# EAGLE schematic PowerPCB (EAGLE 9.4.2)
Assembly variants: basic, pinout

## Sheet 1 of 2: DC-DC converters
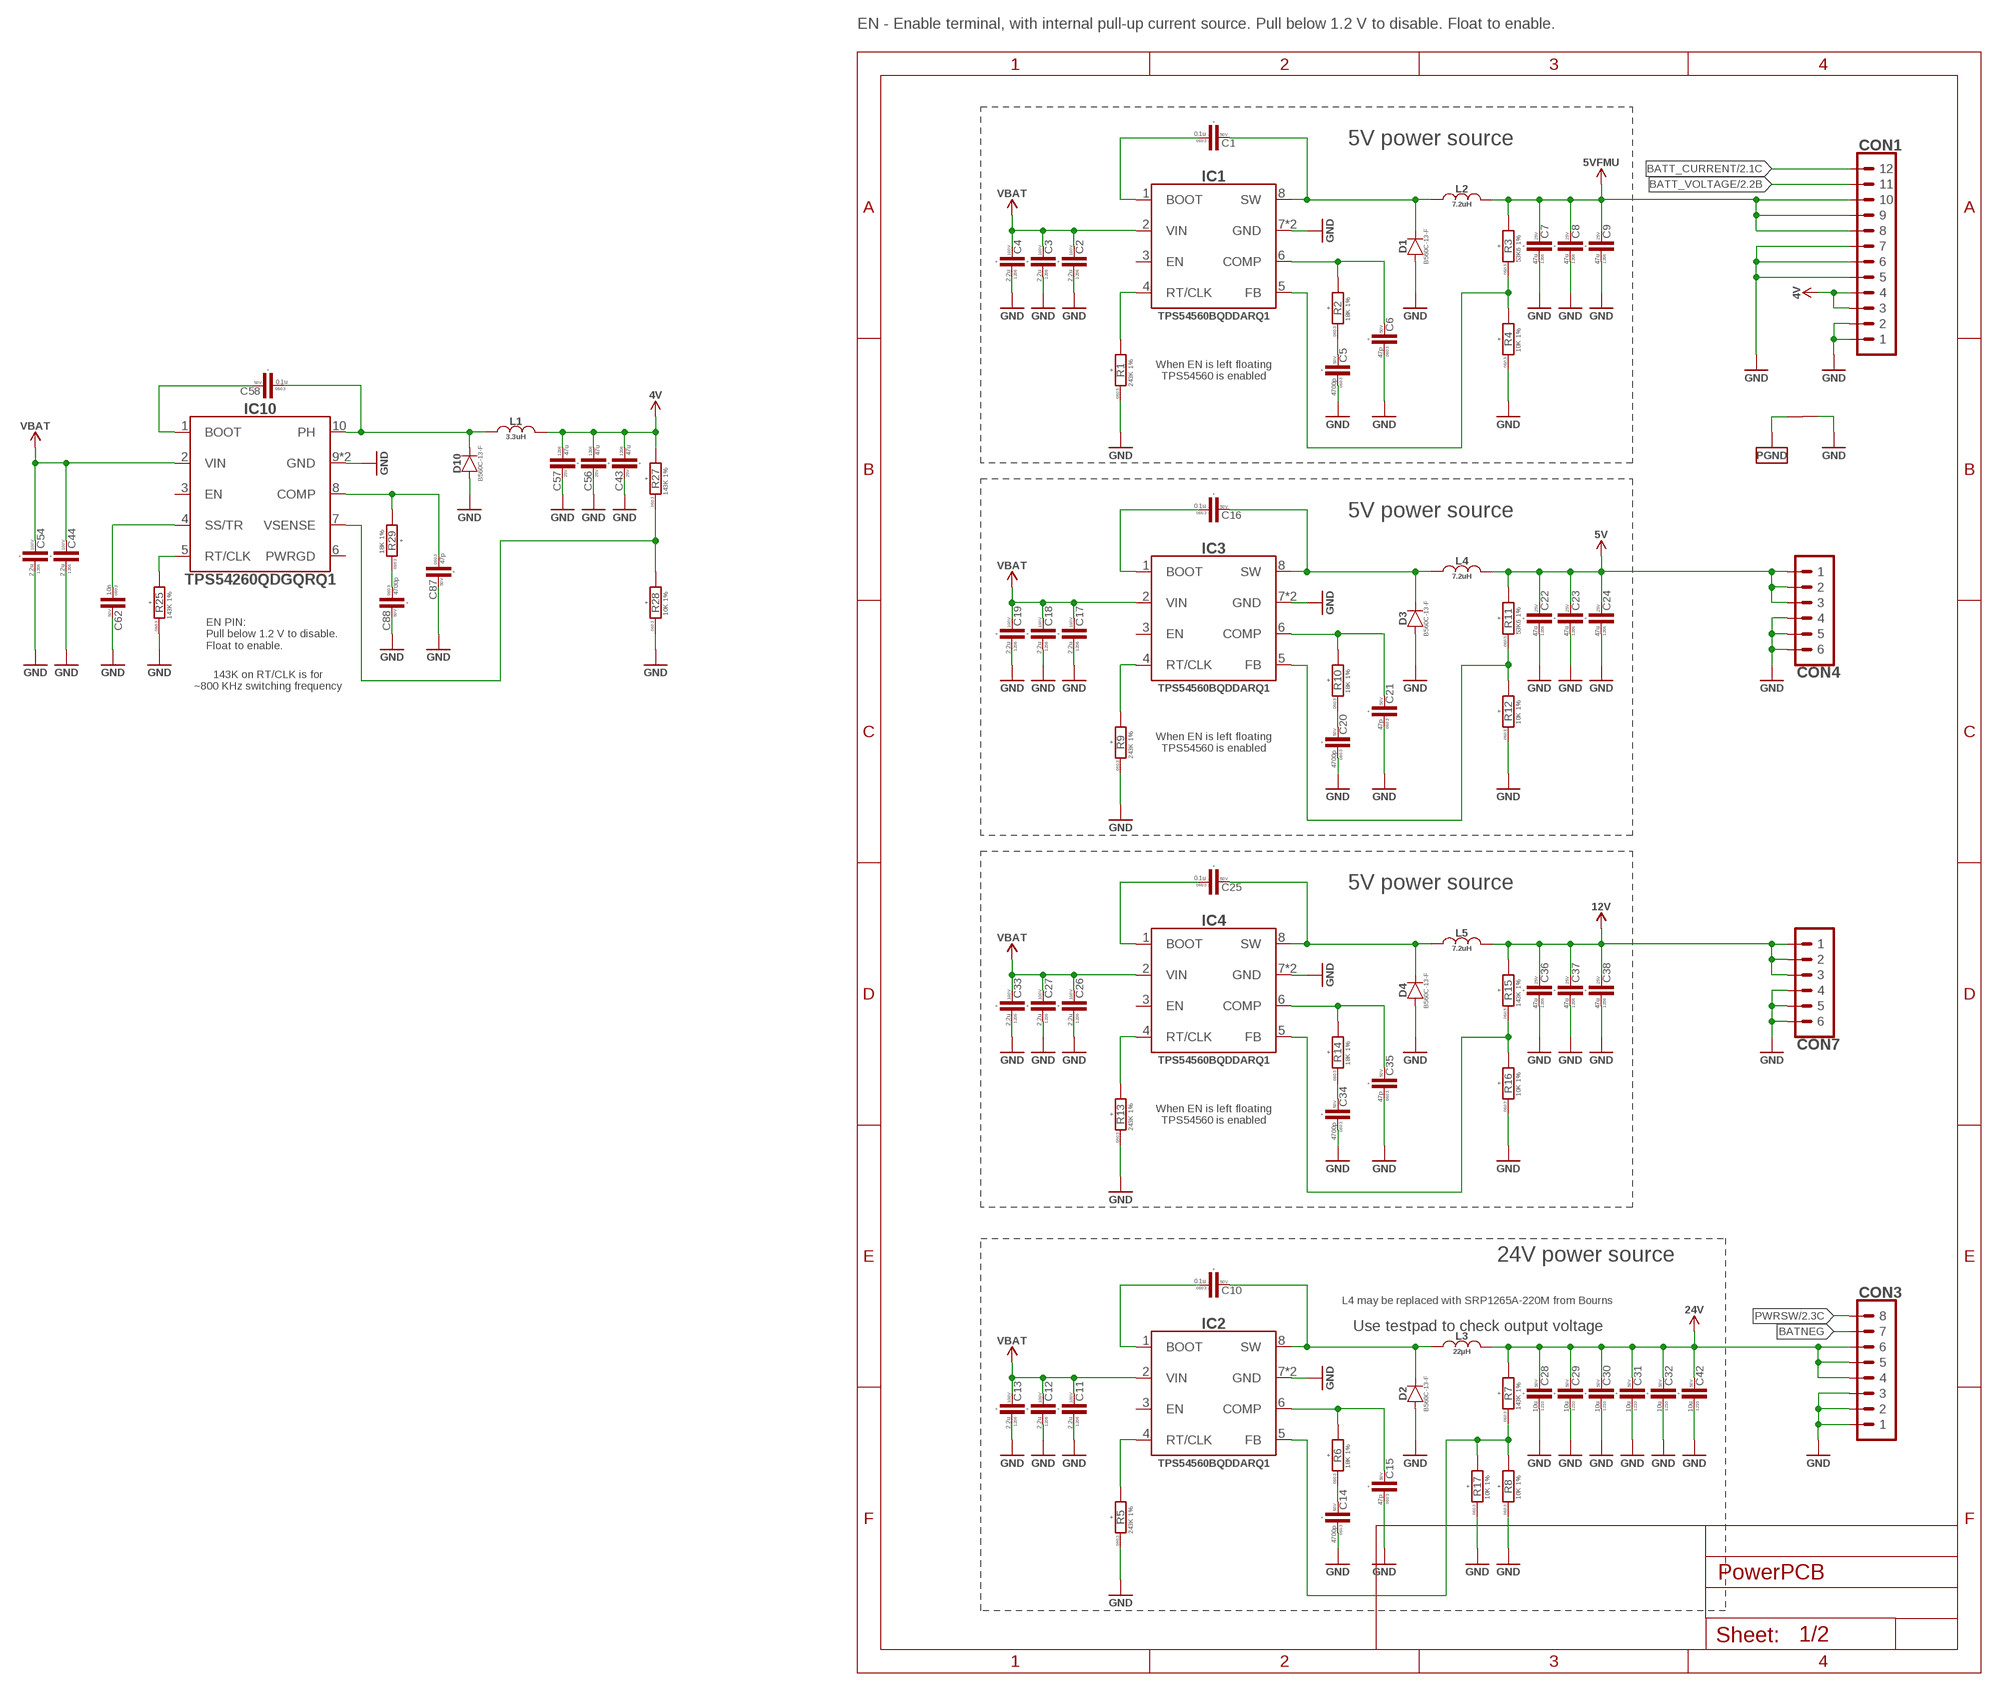
[diagram p0: schematic, sheet 1]

### Parts
C1  0.1u  C-0603  [C0603]
C2  2.2u  C-1206  [C1206]
C3  2.2u  C-1206  [C1206]
C4  2.2u  C-1206  [C1206]
C5  4700p  C-0603  [C0603]
C6  47p  C-0603  [C0603]
C7  47u  C-1206  [C1206]
C8  47u  C-1206  [C1206]
C9  47u  C-1206  [C1206]
C10  0.1u  C-0603  [C0603]
C11  2.2u  C-1206  [C1206]
C12  2.2u  C-1206  [C1206]
C13  2.2u  C-1206  [C1206]
C14  4700p  C-0603  [C0603]
C15  47p  C-0603  [C0603]
C16  0.1u  C-0603  [C0603]
C17  2.2u  C-1206  [C1206]
C18  2.2u  C-1206  [C1206]
C19  2.2u  C-1206  [C1206]
C20  4700p  C-0603  [C0603]
C21  47p  C-0603  [C0603]
C22  47u  C-1206  [C1206]
C23  47u  C-1206  [C1206]
C24  47u  C-1206  [C1206]
C25  0.1u  C-0603  [C0603]
C26  2.2u  C-1206  [C1206]
C27  2.2u  C-1206  [C1206]
C28  10u  C-1210  [C1210]
C29  10u  C-1210  [C1210]
C30  10u  C-1210  [C1210]
C31  10u  C-1210  [C1210]
C32  10u  C-1210  [C1210]
C33  2.2u  C-1206  [C1206]
C34  4700p  C-0603  [C0603]
C35  47p  C-0603  [C0603]
C36  47u  C-1206  [C1206]
C37  47u  C-1206  [C1206]
C38  47u  C-1206  [C1206]
C42  10u  C-1210  [C1210]
C43  47u  C-1206  [C1206]
C44  2.2u  C-1206  [C1206]
C54  2.2u  C-1206  [C1206]
C56  47u  C-1206  [C1206]
C57  47u  C-1206  [C1206]
C58  0.1u  C-0603  [C0603]
C62  10n  C-0603  [C0603]
C87  47p  C-0603  [C0603]
C88  4700p  C-0603  [C0603]
CON1  PINHEAD_1X12-2.54-FEMALE  [1X12-PTH-2.54-FEMALE]
CON3  PINHEAD_1X08-2.54-FEMALE  [1X08-PTH-2.54-FEMALE]
CON4  PINHEAD_1X06-2.54-FEMALE  [1X06-PTH-2.54-FEMALE]
CON7  PINHEAD_1X06-2.54-FEMALE  [1X06-PTH-2.54-FEMALE]
D1  B560C  [DO-214AB(SMC)]
D2  B560C  [DO-214AB(SMC)]
D3  B560C  [DO-214AB(SMC)]
D4  B560C  [DO-214AB(SMC)]
D10  B560C  [DO-214AB(SMC)]
IC1  TPS54560B  [SOIC8-POWERPAD]
IC2  TPS54560B  [SOIC8-POWERPAD]
IC3  TPS54560B  [SOIC8-POWERPAD]
IC4  TPS54560B  [SOIC8-POWERPAD]
IC10  TPS54260  [MSOP10]
J1  CONNECTION-7MM  [CONNECTION_7MM]
L1  3.3uH  3.3µH-IHLP-202BZ  [IHLP-2020BZ-01]
L2  7.2uH  7.2µH-1064  [1064]
L3  22µH  22µH-SRP1265A  [SRP1265A]
L4  7.2uH  7.2µH-1064  [1064]
L5  7.2uH  7.2µH-1064  [1064]
R1  243K  R-1%-0603  [R0603]
R2  18K  R-1%-0603  [R0603]
R3  53K6  R-1%-0603  [R0603]
R4  10K  R-1%-0603  [R0603]
R5  243K  R-1%-0603  [R0603]
R6  18K  R-1%-0603  [R0603]
R7  143K  R-1%-0603  [R0603]
R8  10K  R-1%-0603  [R0603]
R9  243K  R-1%-0603  [R0603]
R10  18K  R-1%-0603  [R0603]
R11  53K6  R-1%-0603  [R0603]
R12  10K  R-1%-0603  [R0603]
R13  243K  R-1%-0603  [R0603]
R14  18K  R-1%-0603  [R0603]
R15  143K  R-1%-0603  [R0603]
R16  10K  R-1%-0603  [R0603]
R17  10K  R-1%-0603  [R0603]
R25  143K  R-1%-0603  [R0603]
R27  143K  R-1%-0603  [R0603]
R28  10K  R-1%-0603  [R0603]
R29  18K  R-1%-0603  [R0603]

### Nets
5VFMU: C7.P$2 C8.P$2 C9.P$2 CON1.8 CON1.9 CON1.10 L2.2 R3.2 ; also sheet 2
BATNEG: CON3.7 ; also sheet 2
BATT_CURRENT: CON1.12 ; also sheet 2
BATT_VOLTAGE: CON1.11 ; also sheet 2
BOOT: C58.2 IC10.1(BOOT)
BOOT1: C1.1 IC1.1(BOOT)
BOOT2: C16.1 IC3.1(BOOT)
BOOT3: C25.1 IC4.1(BOOT)
GND: C2.P$1 C3.P$1 C4.P$1 C5.1 C6.1 C7.P$1 C8.P$1 C9.P$1 C11.P$1 C12.P$1 C13.P$1 C14.1 C15.1 C17.P$1 C18.P$1 C19.P$1 C20.1 C21.1 C22.P$1 C23.P$1 C24.P$1 C26.P$1 C27.P$1 C28.1 C29.1 C30.1 C31.1 C32.1 C33.P$1 C34.1 C35.1 C36.P$1 C37.P$1 C38.P$1 C42.1 C43.P$2 C44.P$1 C54.P$1 C56.P$2 C57.P$2 C62.2 C87.2 C88.2 CON1.1 CON1.2 CON1.5 CON1.6 CON1.7 CON3.1 CON3.2 CON3.3 CON4.4 CON4.5 CON4.6 CON7.4 CON7.5 CON7.6 D1.A D2.A D3.A D4.A D10.A IC1.7(GND) IC1.P$1(GND) IC2.7(GND) IC2.P$1(GND) IC3.7(GND) IC3.P$1(GND) IC4.7(GND) IC4.P$1(GND) IC10.9(GND) IC10.EP(GND) J1.2 R1.1 R4.1 R5.1 R8.1 R9.1 R12.1 R13.1 R16.1 R17.1 R25.1 R28.1 ; also sheet 2
N$1: IC1.4(RT/CLK) R1.2
N$2: IC3.4(RT/CLK) R9.2
N$3: C6.2 IC1.6(COMP) R2.2
N$4: C5.2 R2.1
N$5: IC1.5(FB) R3.1 R4.2
N$6: C21.2 IC3.6(COMP) R10.2
N$7: C10.1 IC2.1(BOOT)
N$8: C10.2 D2.C IC2.8(SW) L3.1
N$9: IC2.4(RT/CLK) R5.2
N$10: C15.2 IC2.6(COMP) R6.2
N$11: C14.2 R6.1
N$12: IC2.5(FB) R7.1 R8.2 R17.2
N$13: C20.2 R10.1
N$14: IC4.4(RT/CLK) R13.2
N$15: IC3.5(FB) R11.1 R12.2
N$16: C35.2 IC4.6(COMP) R14.2
N$17: C34.2 R14.1
N$18: IC4.5(FB) R15.1 R16.2
N$20: C62.1 IC10.4(SS/TR)
N$38: C87.1 IC10.8(COMP) R29.2
N$39: IC10.5(RT/CLK) R25.2
N$50: C88.1 R29.1
PGND: J1.1 ; also sheet 2
PH: C58.1 D10.C IC10.10(PH) L1.P$1
PWRSW: CON3.8 ; also sheet 2
SW1: C1.2 D1.C IC1.8(SW) L2.1
SW2: C16.2 D3.C IC3.8(SW) L4.1
SW3: C25.2 D4.C IC4.8(SW) L5.1
VBAT [HV]: C2.P$2 C3.P$2 C4.P$2 C11.P$2 C12.P$2 C13.P$2 C17.P$2 C18.P$2 C19.P$2 C26.P$2 C27.P$2 C33.P$2 C44.P$2 C54.P$2 IC1.2(VIN) IC2.2(VIN) IC3.2(VIN) IC4.2(VIN) IC10.2(VIN) ; also sheet 2
VDD_4V: C43.P$1 C56.P$1 C57.P$1 CON1.3 CON1.4 L1.P$2 R27.2 ; supply symbol labelled 4V
VDD_5V: C22.P$2 C23.P$2 C24.P$2 CON4.1 CON4.2 CON4.3 L4.2 R11.2 ; supply symbol labelled 5V
VDD_12V: C36.P$2 C37.P$2 C38.P$2 CON7.1 CON7.2 CON7.3 L5.2 R15.2 ; supply symbol labelled 12V
VDD_24V: C28.2 C29.2 C30.2 C31.2 C32.2 C42.2 CON3.4 CON3.5 CON3.6 L3.2 R7.2 ; supply symbol labelled 24V
VSENSE: IC10.7(VSENSE) R27.1 R28.2
Unconnected: IC1.3(EN) IC2.3(EN) IC3.3(EN) IC4.3(EN) IC10.3(EN) IC10.6(PWRGD)

### Notes on the sheet
- EN - Enable terminal, with internal pull-up current source. Pull below 1.2 V to disable. Float to enable.
- 5V power source
- When EN is left floating
  TPS54560 is enabled
- 5V power source
- EN PIN:
  Pull below 1.2 V to disable. 
  Float to enable.
- 143K on RT/CLK is for
  ~800 KHz switching frequency
- When EN is left floating
  TPS54560 is enabled
- 5V power source
- When EN is left floating
  TPS54560 is enabled
- 24V power source
- L4 may be replaced with SRP1265A-220M from Bourns
- Use testpad to check output voltage

## Sheet 2 of 2: ESC and battery power connections
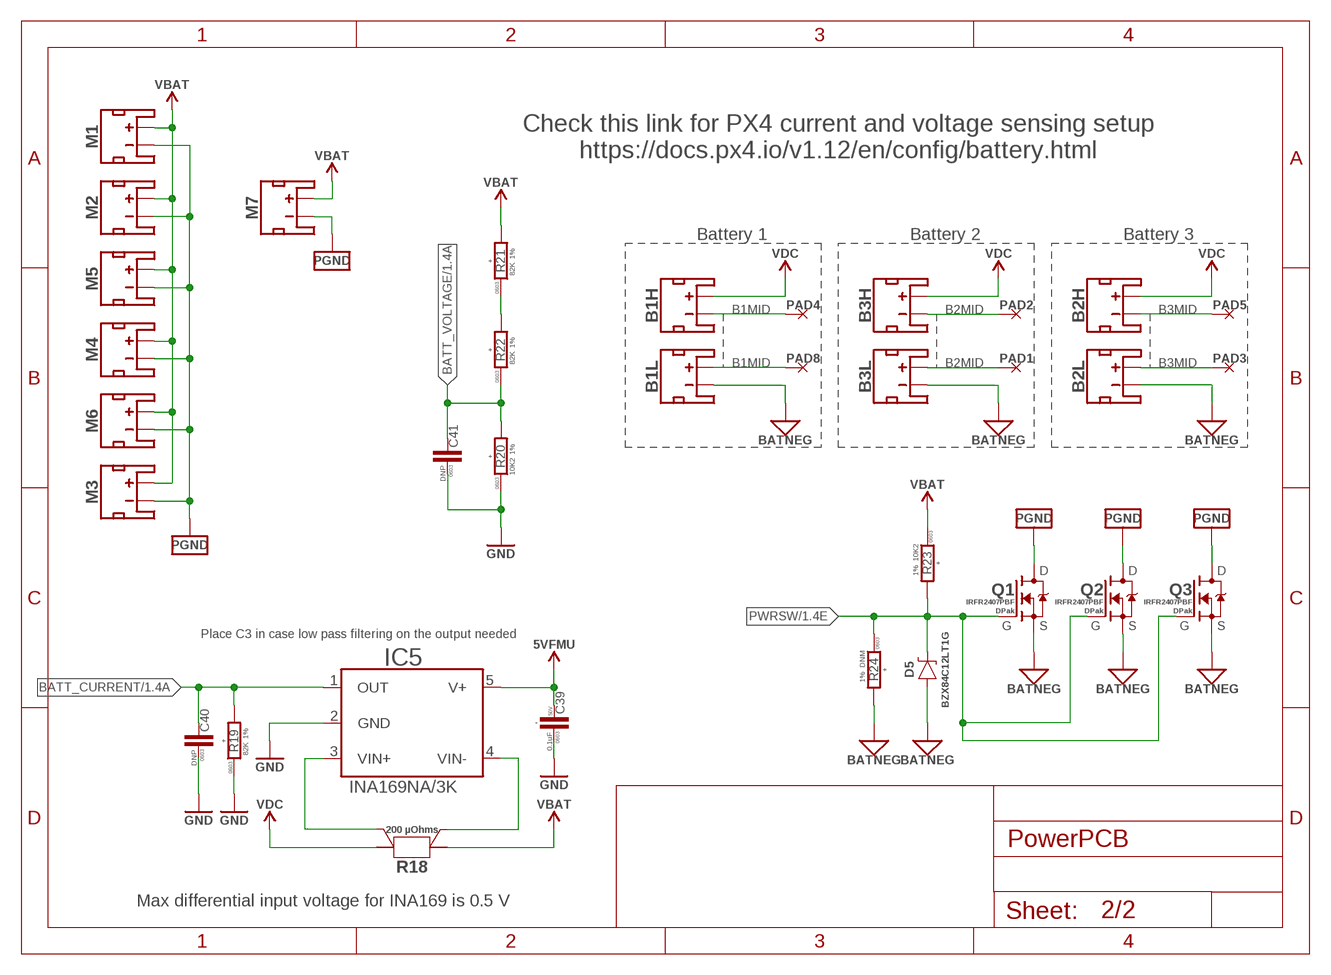
[diagram p1: schematic, sheet 2]

### Parts
B1H  BATTERY_CON-XT60PW-M  [XT60PW-M]
B1L  BATTERY_CON-XT60PW-M  [XT60PW-M]
B2H  BATTERY_CON-XT60PW-M  [XT60PW-M]
B2L  BATTERY_CON-XT60PW-M  [XT60PW-M]
B3H  BATTERY_CON-XT60PW-M  [XT60PW-M]
B3L  BATTERY_CON-XT60PW-M  [XT60PW-M]
C39  0.1uF  C-0603  [C0603]  (not fitted in variant pinout)
C40  DNP  C-0603  [C0603]  (not fitted in variant basic)  (not fitted in variant pinout)
C41  DNP  C-0603  [C0603]  (not fitted in variant basic)  (not fitted in variant pinout)
D5  BZX84C12  [SOT23]
IC5  INA169  [SOT23-5]  (not fitted in variant pinout)
M1  BATTERY_CON-XT30-RA  [XT30-RA]
M2  BATTERY_CON-XT30-RA  [XT30-RA]
M3  BATTERY_CON-XT30-RA  [XT30-RA]
M4  BATTERY_CON-XT30-RA  [XT30-RA]
M5  BATTERY_CON-XT30-RA  [XT30-RA]
M6  BATTERY_CON-XT30-RA  [XT30-RA]
M7  BATTERY_CON-XT30-RA  [XT30-RA]
PAD1  PAD-10X4  [10X4]  (not fitted in variant basic)  (not fitted in variant pinout)
PAD2  PAD-10X4  [10X4]  (not fitted in variant basic)  (not fitted in variant pinout)
PAD3  PAD-10X4  [10X4]  (not fitted in variant basic)  (not fitted in variant pinout)
PAD4  PAD-10X4  [10X4]  (not fitted in variant basic)  (not fitted in variant pinout)
PAD5  PAD-10X4  [10X4]  (not fitted in variant basic)  (not fitted in variant pinout)
PAD8  PAD-10X4  [10X4]  (not fitted in variant basic)  (not fitted in variant pinout)
Q1  IRFR2407PBF  [D-PAK]
Q2  IRFR2407PBF  [D-PAK]
Q3  IRFR2407PBF  [D-PAK]
R18  200 µOhms  CURRENT_SHUNT_KELVIN-0.0002R-3920-KELVIN  [R3920-KELVIN]  (not fitted in variant pinout)
R19  82K  R-1%-0603  [R0603]  (not fitted in variant pinout)
R20  10K2  R-1%-0603  [R0603]  (not fitted in variant pinout)
R21  82K  R-1%-0603  [R0603]  (not fitted in variant pinout)
R22  82K  R-1%-0603  [R0603]  (not fitted in variant pinout)
R23  10K2  R-1%-0603  [R0603]
R24  DNM  R-1%-0603  [R0603]

### Nets
5VFMU: C39.2 IC5.5(V+) ; also sheet 1
B1MID: B1H.- B1L.+ PAD4.P$1 PAD8.P$1
B2MID: B3H.- B3L.+ PAD1.P$1 PAD2.P$1
B3MID: B2H.- B2L.+ PAD3.P$1 PAD5.P$1
BATNEG: B1L.- B2L.- B3L.- D5.1(A) Q1.S Q2.S Q3.S R24.2 ; also sheet 1
BATT_CURRENT: C40.2 IC5.1(OUT) R19.2 ; also sheet 1
BATT_VOLTAGE: C41.2 R20.2 R22.1 ; also sheet 1
GND: C39.1 C40.1 C41.1 IC5.2(GND) R19.1 R20.1 ; also sheet 1
N$19: IC5.4(VIN-) R18.S2
N$21: IC5.3(VIN+) R18.S1
N$22: R21.1 R22.2
PGND: M1.- M2.- M3.- M4.- M5.- M6.- M7.- Q1.D Q2.D Q3.D ; also sheet 1
PWRSW: D5.3(C) Q1.G Q2.G Q3.G R23.2 R24.1 ; also sheet 1
VBAT [HV]: M1.+ M2.+ M3.+ M4.+ M5.+ M6.+ M7.+ R18.2 R18.22 R21.2 R23.1 ; also sheet 1
VDC [HV]: B1H.+ B2H.+ B3H.+ R18.1 R18.11
Unconnected: B1H.P$3(PAD1) B1H.P$4(PAD2) B1L.P$3(PAD1) B1L.P$4(PAD2) B2H.P$3(PAD1) B2H.P$4(PAD2) B2L.P$3(PAD1) B2L.P$4(PAD2) B3H.P$3(PAD1) B3H.P$4(PAD2) B3L.P$3(PAD1) B3L.P$4(PAD2) M1.P$3(PAD1) M1.P$4(PAD2) M2.P$3(PAD1) M2.P$4(PAD2) M3.P$3(PAD1) M3.P$4(PAD2) M4.P$3(PAD1) M4.P$4(PAD2) M5.P$3(PAD1) M5.P$4(PAD2) M6.P$3(PAD1) M6.P$4(PAD2) M7.P$3(PAD1) M7.P$4(PAD2)

### Notes on the sheet
- Check this link for PX4 current and voltage sensing setup
  https://docs.px4.io/v1.12/en/config/battery.html
- Battery 1 | Battery 2 | Battery 3
- Place C3 in case low pass filtering on the output needed
- Max differential input voltage for INA169 is 0.5 V

## Library data of the parts
B1H B1L B2H B2L B3H B3L = Connectors:BATTERY_CON
C1 C10 C16 C25 C39 C58 = rc:C; ALLOCATED: +; LCSC#: C14663; MANF: YAGEO; MANF#: CC0603KRX7R9BB104; PACKAGE: 0603; VOLTAGE: 50V
C2-C4 C11-C13 C17-C19 C26 C27 C33 C44 C54 = rc:C; ALLOCATED: +; LCSC#: C170101; MANF: Samsung Electro-Mechanics; MANF#: CL31B225KCHSNNE; PACKAGE: 1206; VOLTAGE: 100V
C5 C14 C20 C34 C88 = rc:C; ALLOCATED: +; LCSC#: C106218; MANF: YAGEO; MANF#: CC0603KRX7R9BB472; PACKAGE: 0603; VOLTAGE: 50V
C6 C15 C21 C35 C87 = rc:C; ALLOCATED: +; LCSC#: C1671; MANF: Samsung Electro-Mechanics; MANF#: CL10C470JB8NNNC; PACKAGE: 0603; VOLTAGE: 50V
C7-C9 C22-C24 C36-C38 C43 C56 C57 = rc:C; ALLOCATED: +; LCSC#: C403725; MANF: Murata Electronics; MANF#: GRM31CR61E476ME44L; PACKAGE: 1206; VOLTAGE: 25V
C28-C32 C42 = rc:C; ALLOCATED: +; LCSC#: C77102; MANF: Murata Electronics; MANF#: GRM32ER71H106K; PACKAGE: 1210; VOLTAGE: 50V
C40 C41 = rc:C; PACKAGE: 0603
C62 = rc:C; PACKAGE: 0603; VOLTAGE: 50V
CON1 = pinhead:PINHEAD_1X12
CON3 = pinhead:PINHEAD_1X08: pinheader 8P
CON4 CON7 = pinhead:PINHEAD_1X06: pinheader 6P
D1-D4 D10 = Diodes:B560C: 60V 700mV@5A 5A SMC(DO-214AB) Schottky Barrier Diodes (SBD) ROHS; LCSC#: C85100; MANF: Diodes Incorporated; MANF#: B560C-13-F
D5 = Diodes:BZX84C: Zener Diode 250mW ±5% Surface Mount SOT-23-3 (TO-236); DIGIKEY#: BZX84C12LT1GOSTR-ND; LCSC#: C82475; MANF: ON Semiconductor; MANF#: BZX84C12LT1G
IC1-IC4 = dc-dc:TPS54560B: Switching Voltage Regulators 4.5V to 60V Input, 5A, Step-Down DC-DC Converter with Eco-mode™ 8-SO PowerPAD -40 to 125 Datasheet <https://www.ti.com/lit/ds/symlink/tps54560b.pdf?ts=1655463669009>; LCSC#: C1355654; MANF: Texas Instruments; MANF#: TPS54560BQDDARQ1
IC5 = misc:INA169: High-Side Measurement Current Shunt Monitor; LCSC#: C44322; MANF: Texas Instruments; MANF#: INA169NA/3K
IC10 = dc-dc:TPS54260: IC REG BUCK ADJ 2.5A 10MSOP Datasheet <http://www.ti.com/lit/ds/slvsa86c/slvsa86c.pdf>; DIGIKEY#: 296-28183-1-ND; MANF: Texas Instruments; MANF#: TPS54260QDGQRQ1
J1 = misc:CONNECTION
L1 = power_inductors:3.3µH; LCSC#: C844988; MANF: Vishay Precision Group; MANF#: IHLP2020BZER3R3M01
L2 L4 L5 = power_inductors:7.2µH; DC_RESISTANCE: 11.3 mOhm; MANF: Wurth Elektronik; MANF#: 7447798720; RATED_CURRENT: 7.9A
L3 = power_inductors:22µH: Wirewound Inductor; LCSC#: C2041465; MANF: Bourns; MANF#: SRP1265A-220M; RATED_CURRENT: 9 A
M1-M7 = Connectors:BATTERY_CON; LINK: https://www.tme.eu/en/details/xt30pw-m/dc-power-connectors/amass/; MANF: AMASS; MANF#: XT30PW-M
PAD1-PAD5 PAD8 = PADS:PAD
Q1-Q3 = mosfet:IRFR2407PBF: N-Channel 75V 42A power MOSFET, Rdson = 0.026 Ohm; LCSC#: C40514; MANF: International Rectifier; MANF#: IRFR2407PBF; PACKAGE: DPak
R1 R5 R9 R13 = rc:R; ALLOCATED: +; LCSC#: C23351; MANF: UNI-ROYAL(Uniroyal Elec); MANF#: 0603WAF2433T5E; PACKAGE: 0603; TOLERANCE: 1%
R2 R6 R10 R14 R29 = rc:R; ALLOCATED: +; LCSC#: C25810; MANF: UNI-ROYAL; MANF#: 0603WAF1802T5E; PACKAGE: 0603; TOLERANCE: 1%
R3 R11 R15 = rc:R; ALLOCATED: +; LCSC#: C23074; MANF: UNI-ROYAL(Uniroyal Elec); MANF#: 0603WAF5362T5E; PACKAGE: 0603; TOLERANCE: 1%
R4 R8 R12 R16 R17 R28 = rc:R; ALLOCATED: +; LCSC#: C160601; MANF: YAGEO; MANF#: RT0603FRD0710KL; PACKAGE: 0603; TOLERANCE: 1%
R7 R25 R27 = rc:R; ALLOCATED: +; LCSC#: C22877; MANF: UNI-ROYAL(Uniroyal Elec); MANF#: 0603WAF1433T5E; PACKAGE: 0603; TOLERANCE: 1%
R18 = SHUNT_RESISTORS:CURRENT_SHUNT_KELVIN; DIGIKEY#: CSS2H-3920R-L200FCT-ND; MANF: Bourns Inc; MANF#: CSS2H-3920R-L200FCT-ND; OPERATING_TEMP: -55°C ~ 170°C; PACKAGE: 3920; POWER: 12W; TC: ±50ppm/°C; TOLERANCE: ±1%
R19 R21 R22 = rc:R; ALLOCATED: +; LCSC#: C23254; MANF: UNI-ROYAL(Uniroyal Elec); MANF#: 0603WAF8202T5E; PACKAGE: 0603; TOLERANCE: 1%
R20 R23 R24 = rc:R; ALLOCATED: +; LCSC#: C22772; MANF: UNI-ROYAL(Uniroyal Elec); MANF#: 0603WAF1022T5E; PACKAGE: 0603; TOLERANCE: 1%

## Net classes
1 HV: clearance 0.3 mm to class 0, clearance 0.3 mm